# EAGLE design Reader 3.0 (EAGLE 9.3.1)
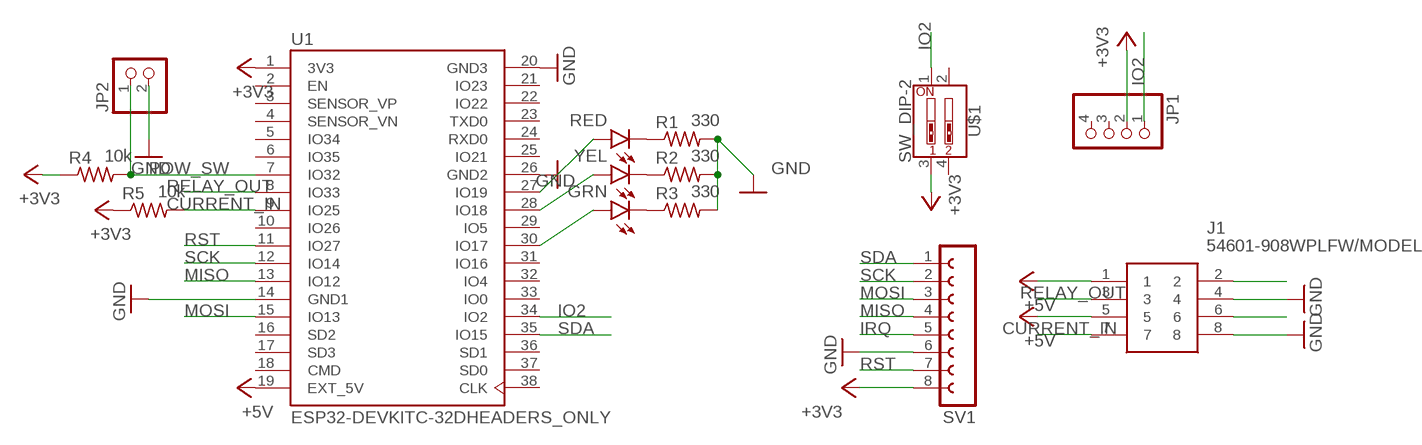
[diagram p0: schematic, sheet 1]

## Parts
GRN  LED5MM  [LED5MM]
J1  54601-908WPLFW/MODEL  [HDRV4W64P254_1X4_1016X508X838B]
JP1  PINHD-1X4/90  [1X04/90]
JP2  PINHD-1X2/90  [1X02/90]
R1  330  R-US  [0204/7]
R2  330  R-US  [0204/7]
R3  330  R-US  [0204/7]
R4  10k  R-US  [0204/7]
R5  10k  R-US  [0204/7]
RED  LED5MM  [LED5MM]
SV1  FE08-1  [HDR_F_1X8]
U1  ESP32-DEVKITC-32DHEADERS_ONLY  [ESP32_DEVKITC_DIP]
U$1  SW_DIP-2  [SW_DIP-2]
YEL  LED5MM  [LED5MM]

## Nets
+3V3: JP1.2 R4.1 R5.1 SV1.8 U1.1(3V3) U$1.3
+5V: J1.1 J1.5 U1.19(EXT_5V)
CURRENT_IN: J1.7 R5.2 U1.9(IO25)
GND: J1.4 J1.8 JP2.2 R1.2 R2.2 R3.2 SV1.6 U1.14(GND1) U1.20(GND3) U1.26(GND2)
IO2: JP1.1 U1.34(IO2) U$1.1
IRQ: SV1.5
MISO: SV1.4 U1.13(IO12)
MOSI: SV1.3 U1.15(IO13)
N$1: GRN.A U1.30(IO17)
N$2: U1.28(IO18) YEL.A
N$3: RED.A U1.27(IO19)
N$4: R1.1 RED.K(C)
N$5: R2.1 YEL.K(C)
N$6: GRN.K(C) R3.1
N$7: J1.2
N$10: J1.6
POW_SW: JP2.1 R4.2 U1.7(IO32)
RELAY_OUT: J1.3 U1.8(IO33)
RST: SV1.7 U1.11(IO27)
SCK: SV1.2 U1.12(IO14)
SDA: SV1.1 U1.35(IO15)
Unconnected: JP1.3 JP1.4 U1.2(EN) U1.3(SENSOR_VP) U1.4(SENSOR_VN) U1.5(IO34) U1.6(IO35) U1.10(IO26) U1.16(SD2) U1.17(SD3) U1.18(CMD) U1.21(IO23) U1.22(IO22) U1.23(TXD0) U1.24(RXD0) U1.25(IO21) U1.29(IO5) U1.31(IO16) U1.32(IO4) U1.33(IO0) U1.36(SD1) U1.37(SD0) U1.38(CLK) U$1.2 U$1.4

## Library data of the parts
GRN RED YEL = led:LED: LED OSRAM: - CHIPLED LG R971, LG N971, LY N971, LG Q971, LY Q971, LO R971, LY R971 LH N974, LH R974 LS Q976, LO Q976, LY Q976 LO Q996 - Hyper CHIPLED LW Q18S LB Q993, LB Q99A, LB R99A - SideLED LS A670, LO A670, LY A670, LG A670, LP A670 LB A673, LV A673, LT A673, LW A673 LH A674 LY A675 LS A676, LA A676, LO A676, LY A676, LW A676 LS A679, LY A679, LG A679 - Hyper Micro SIDELED® LS Y876, LA Y876, LO Y876, LY Y876 LT Y87S - SmartLED LW L88C, LW L88S LB L89C, LB L89S, LG L890 LS L89K, LO L89K, LY L89K LS L896, LA L896, LO L896, LY L896 - TOPLED LS T670, LO T670, LY T670, LG T670, LP T670 LSG T670, LSP T670, LSY T670, LOP T670, LYG T670 LG T671, LOG T671, LSG T671 LB T673, LV T673, LT T673, LW T673 LH T674 LS T676, LA T676, LO T676, LY T676, LB T676, LH T676, LSB T676, LW T676 LB T67C, LV T67C, LT T67C, LS T67K, LO T67K, LY T67K, LW E67C LS E67B, LA E67B, LO E67B, LY E67B, LB E67C, LV E67C, LT E67C LW T67C LS T679, LY T679, LG T679 LS T770, LO T770, LY T770, LG T770, LP T770 LB T773, LV T773, LT T773, LW T773 LH T774 LS E675, LA E675, LY E675, LS T675 LS T776, LA T776, LO T776, LY T776, LB T776 LHGB T686 LT T68C, LB T68C - Hyper Mini TOPLED® LB M676 - Mini TOPLED Santana® LG M470 LS M47K, LO M47K, LY M47K Source: http://www.osram.convergy.de LUXEON: - LUMILED® LXK2-PW12-R00, LXK2-PW12-S00, LXK2-PW14-U00, LXK2-PW14-V00 LXK2-PM12-R00, LXK2-PM12-S00, LXK2-PM14-U00 LXK2-PE12-Q00, LXK2-PE12-R00, LXK2-PE12-S00, LXK2-PE14-T00, LXK2-PE14-U00 LXK2-PB12-K00, LXK2-PB12-L00, LXK2-PB12-M00, LXK2-PB14-N00, LXK2-PB14-P00, LXK2-PB14-Q00 LXK2-PR12-L00, LXK2-PR12-M00, LXK2-PR14-Q00, LXK2-PR14-R00 LXK2-PD12-Q00, LXK2-PD12-R00, LXK2-PD12-S00 LXK2-PH12-R00, LXK2-PH12-S00 LXK2-PL12-P00, LXK2-PL12-Q00, LXK2-PL12-R00 Source: www.luxeon.com KINGBRIGHT: KA-3528ASYC Source: www.kingbright.com
J1 = mcp:54601-908WPLF: Modular Connectors / Ethernet Connectors 8P8C CAT 3 MOD JACK HORIZ. 1 PORT Source: Datasheet <https://www.mouser.ch/datasheet/2/18/c-bmj-0051-1365214.pdf>
JP1 = mcp:PINHD-1X4: PIN HEADER
JP2 = mcp:PINHD-1X2: PIN HEADER
R1-R5 = mcp:R-US
SV1 = mcp:FE08-1: FEMALE HEADER
U1 = mcp:ESP32-DEVKITC-32D: Eval Board For Esp-Wroom-32; SPICEPREFIX: X
U$1 = mcp:SW_DIP-2

## Board
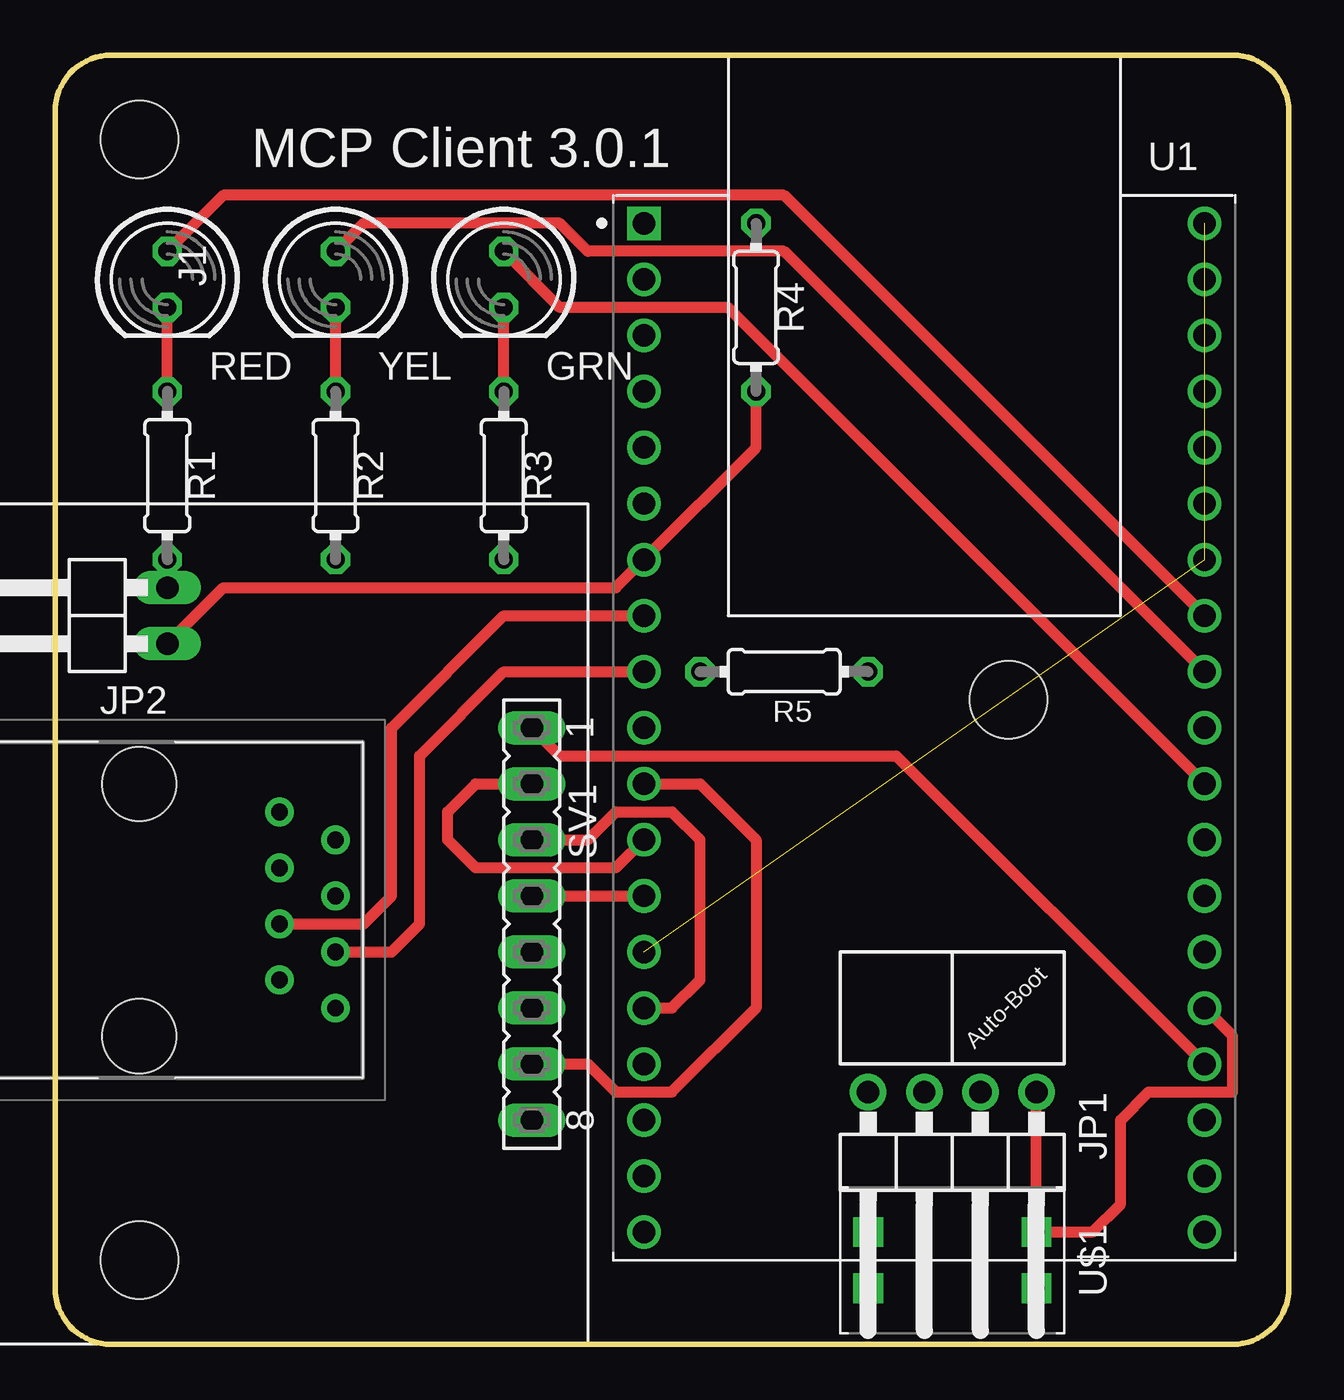
[diagram p1: board, top side]
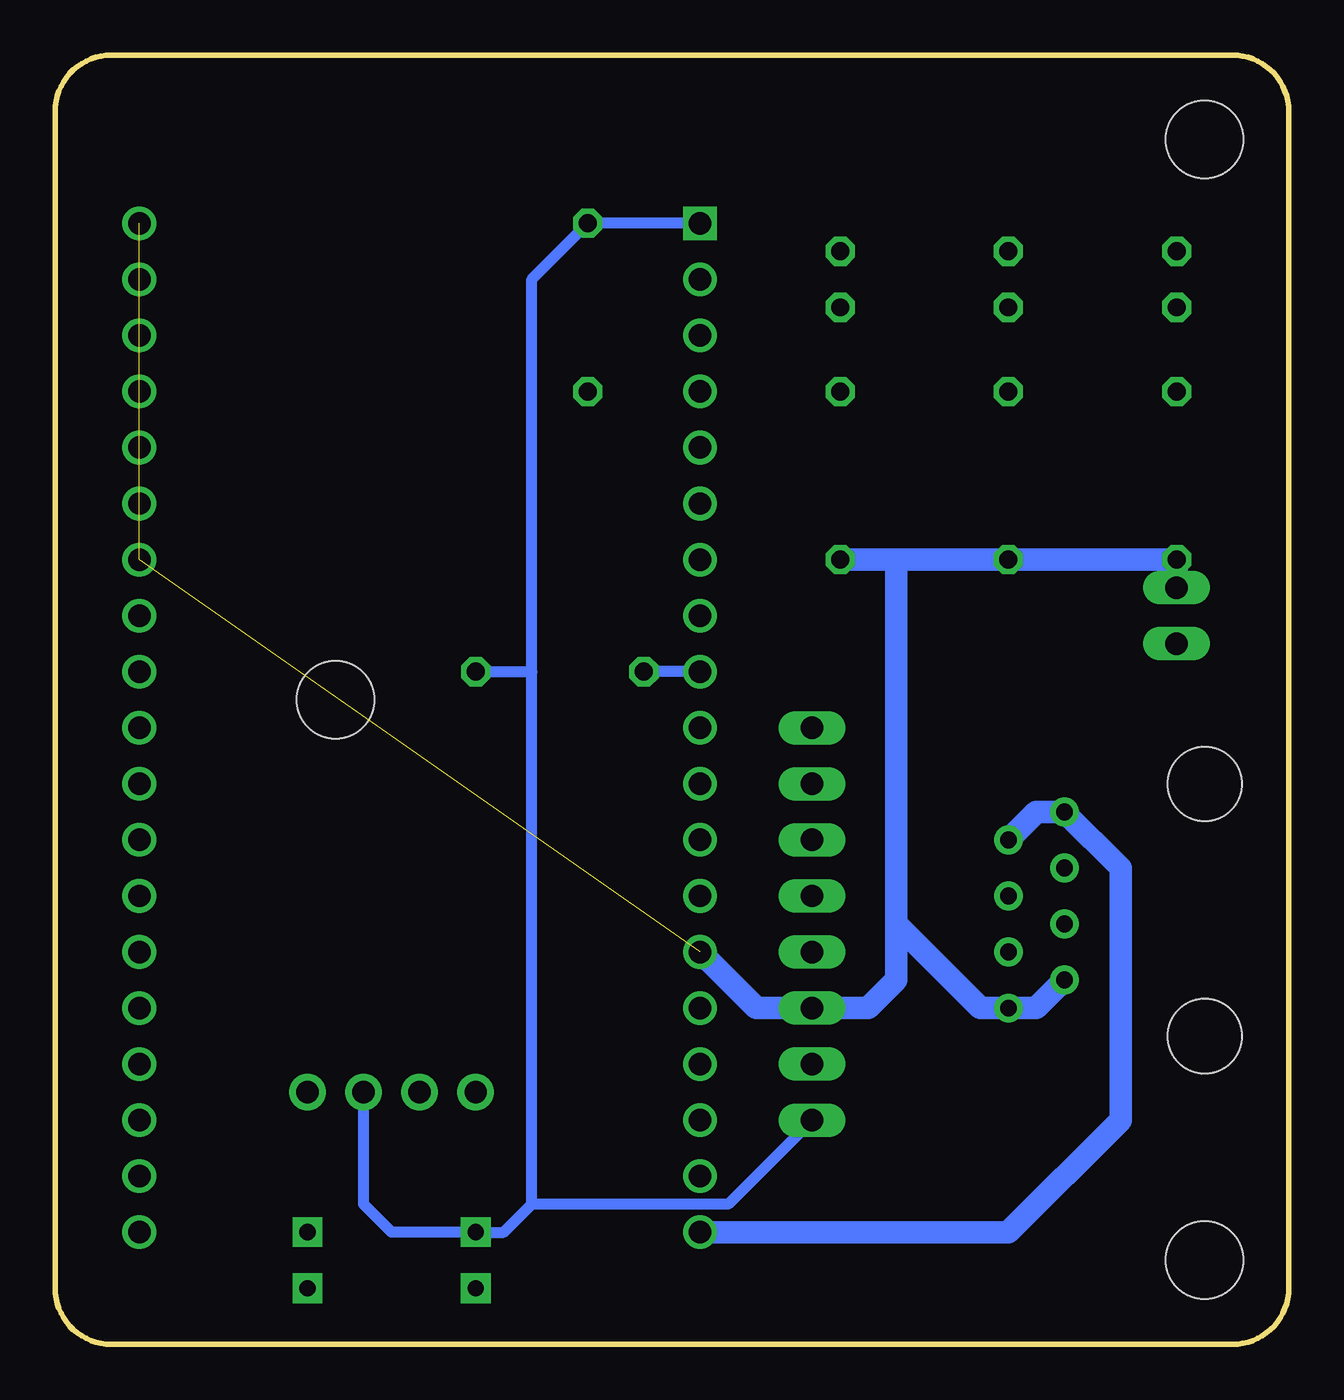
[diagram p2: board, bottom side, seen from below]

Size 55.88 x 58.42 mm. Coordinates in mm from the lower left corner, seen from the top.
Outline: 2.54,0 53.34,0 arc90 55.88,2.54 55.88,55.88 arc90 53.34,58.42 2.54,58.42 arc90 0,55.88 0,2.54 arc90 2.54,0
Copper layers (1*16): Top 0.035mm / dielectric 1.5mm / Bottom 0.035mm
Design rules "default": minimum track width 6mil, minimum drill 0.35mm, track to track 6mil, track to pad 6mil, pad to pad 6mil, via to via 6mil, smd to smd 6mil, copper to edge 40mil, drill to drill 6mil, minimum pad ring 10mil, minimum via ring 8mil, stop-mask expansion 4mil, vias tented up to drill 0mil, thermal gap 10mil
Holes 3.5 mm at 3.81,54.61 3.81,3.81 43.18,29.21
tRestrict: area 0.6,51.4 to 7.1,57.9; area 0.6,0.6 to 7.1,7.1; area 39.9,26 to 46.4,32.5

### Footprints (pad centres in the part's own frame; a part is rotated, then mirrored left to right if it is on the bottom)
LED5MM = drill 0.813 octagon: A -1.27,0; K 1.27,0
HDRV4W64P254_1X4_1016X508X838B = drill 0.76 pad 1.303: 1 0,0; 2 2.54,0; 3 5.08,0; 4 7.62,0; 5 1.27,2.54; 6 3.81,2.54; 7 6.35,2.54; 8 8.89,2.54 | hole 3.35: -1.271,-6.35; 10.161,-6.35
1X04/90 = drill 1.016 pad 1.651: 1 -3.81,-3.81; 2 -1.27,-3.81; 3 1.27,-3.81; 4 3.81,-3.81
1X02/90 = drill 1.016 long: 1 -1.27,-3.81; 2 1.27,-3.81
0204/7 = drill 0.813 octagon: 1 -3.81,0; 2 3.81,0
HDR_F_1X8 = drill 1.016 long: 1 -8.89,0; 2 -6.35,0; 3 -3.81,0; 4 -1.27,0; 5 1.27,0; 6 3.81,0; 7 6.35,0; 8 8.89,0
ESP32_DEVKITC_DIP = drill 1.016 square: 1 -12.7,22.86 | drill 1.016: 2 -12.7,20.32; 3 -12.7,17.78; 4 -12.7,15.24; 5 -12.7,12.7; 6 -12.7,10.16; 7 -12.7,7.62; 8 -12.7,5.08; 9 -12.7,2.54; 10 -12.7,0; 11 -12.7,-2.54; 12 -12.7,-5.08; 13 -12.7,-7.62; 14 -12.7,-10.16; 15 -12.7,-12.7; 16 -12.7,-15.24; 17 -12.7,-17.78; 18 -12.7,-20.32; 19 -12.7,-22.86; 20 12.7,22.86; 21 12.7,20.32; 22 12.7,17.78; 23 12.7,15.24; 24 12.7,12.7; 25 12.7,10.16; 26 12.7,7.62; 27 12.7,5.08; 28 12.7,2.54; 29 12.7,0; 30 12.7,-2.54; 31 12.7,-5.08; 32 12.7,-7.62; 33 12.7,-10.16; 34 12.7,-12.7; 35 12.7,-15.24; 36 12.7,-17.78; 37 12.7,-20.32; 38 12.7,-22.86
SW_DIP-2 = drill 0.743 pad 1.343 square: 1 -1.27,3.81; 2 1.27,3.81; 3 -1.27,-3.81; 4 1.27,-3.81

### Placement (x,y rotation side)
GRN  20.32,48.26 270 top
J1  10.16,24.13 270 top
JP1  40.64,7.62 180 top
JP2  1.27,33.02 90 top
R1  5.08,39.37 270 top
R2  12.7,39.37 270 top
R3  20.32,39.37 270 top
R4  31.75,46.99 270 top
R5  33.02,30.48 180 top
RED  5.08,48.26 270 top
SV1  21.59,19.05 270 top
U1  39.37,27.94 0 top
U$1  40.64,3.81 270 top
YEL  12.7,48.26 270 top

### Tracks (layer width: path | path; a pad name or v marks a point on that pad's centre or on a via)
+3V3
  Bottom 0.508: SV1.8 25.4,6.35 34.29,6.35 | U1.1 R4.1 34.29,48.26 34.29,30.48 | 34.29,6.35 34.29,30.48 | 34.29,6.35 35.56,5.08 U$1.3 40.64,5.08 41.91,6.35 JP1.2 | R5.1 34.29,30.48
+5V
  Bottom 1.016: U1.19 12.7,5.08 7.62,10.16 7.62,21.59 J1.1 11.43,24.13 J1.5
CURRENT_IN
  Top 0.508: J1.7 15.24,17.78 16.51,19.05 16.51,26.67 20.32,30.48 U1.9
  Bottom 0.508: U1.9 R5.2
GND  (2 unrouted)
  Bottom 1.016: U1.14 24.13,15.24 SV1.6 19.05,15.24 17.78,16.51 17.78,19.05 | R3.2 17.78,35.56 | 17.78,35.56 R2.2 R1.2 JP2.2 | 17.78,19.05 13.97,15.24 J1.8 11.43,15.24 J1.4 | 17.78,19.05 17.78,35.56
IO2
  Top 0.508: U1.34 53.34,13.97 53.34,11.43 49.53,11.43 48.26,10.16 48.26,6.35 46.99,5.08 U$1.1 JP1.1
MISO
  Top 0.508: SV1.4 U1.13
MOSI
  Top 0.508: SV1.3 24.13,22.86 25.4,24.13 27.94,24.13 29.21,22.86 29.21,16.51 27.94,15.24 U1.15
N$1
  Top 0.508: GRN.A 22.86,46.99 30.48,46.99 U1.30
N$2
  Top 0.508: U1.28 33.02,49.53 24.13,49.53 22.86,50.8 13.97,50.8 YEL.A
N$3
  Top 0.508: RED.A 7.62,52.07 33.02,52.07 U1.27
N$4
  Top 0.508: R1.1 RED.K
N$5
  Top 0.508: R2.1 YEL.K
N$6
  Top 0.508: R3.1 GRN.K
POW_SW
  Top 0.508: R4.2 31.75,40.64 U1.7 25.4,34.29 7.62,34.29 JP2.1
RELAY_OUT
  Top 0.508: J1.3 13.97,19.05 15.24,20.32 15.24,27.94 20.32,33.02 U1.8
RST
  Top 0.508: SV1.7 24.13,12.7 25.4,11.43 27.94,11.43 31.75,15.24 31.75,22.86 29.21,25.4 U1.11
SCK
  Top 0.508: U1.12 25.4,21.59 19.05,21.59 17.78,22.86 17.78,24.13 19.05,25.4 SV1.2
SDA
  Top 0.508: SV1.1 22.86,26.67 38.1,26.67 U1.35

### Text on the board
tPlace: MCP Client 3.0.1 | Auto-Boot